# EasyEDA Pro project Board.eprj, board PCB
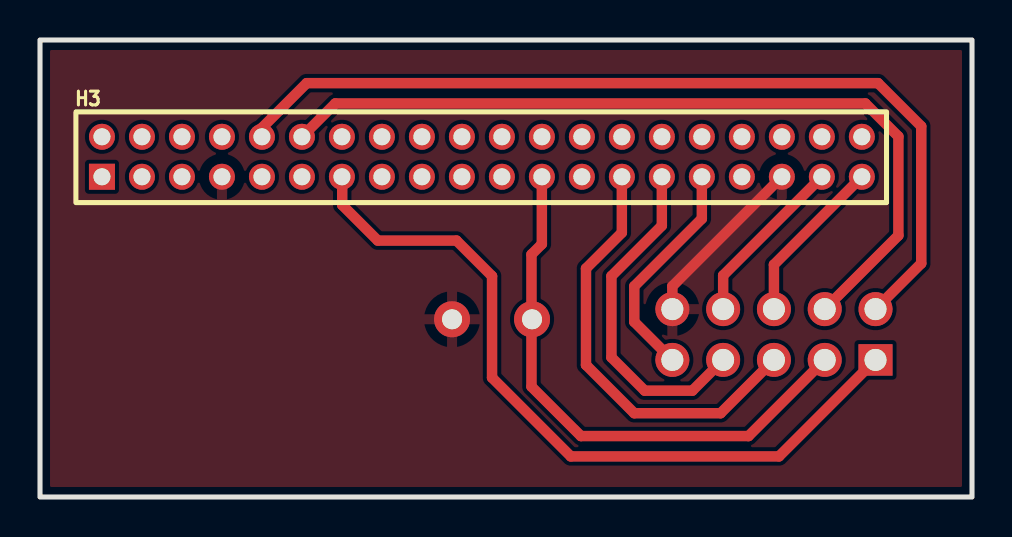
[diagram p2: board, top side]
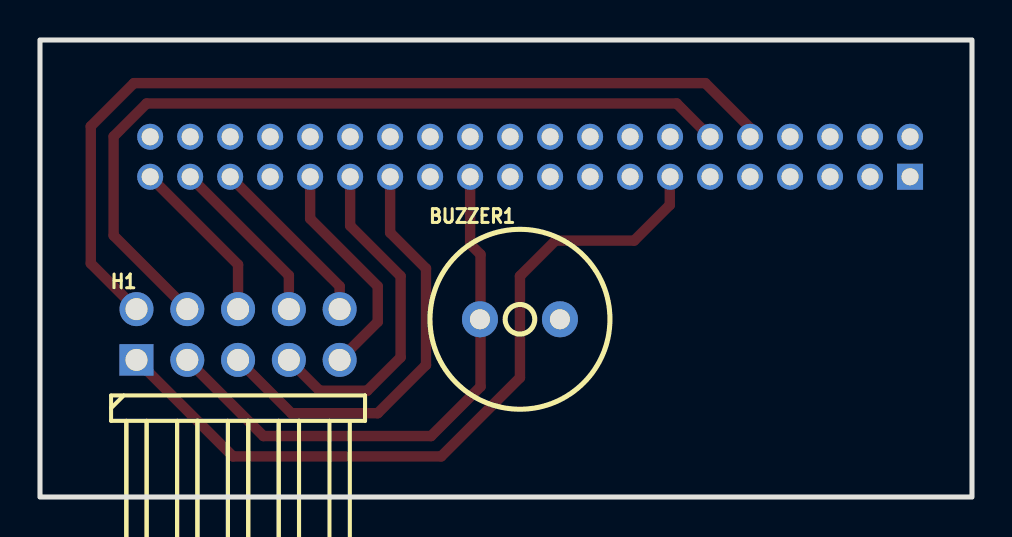
[diagram p3: board, bottom side, seen from below]

Outline 46.61 x 22.86 mm; copper layers: Top Layer, Bottom Layer. Coordinates in mm from the lower left corner of the outline.
Outline path: rectangle 0,22.86 46.61,0
Stack: Top Layer 0.035mm / Dielectric1 1.51mm FR4 er 4.5 / Bottom Layer 0.035mm

## Design rules (mm)
template: Custom Config
spacing copperThickness1oz (default): track to track 0.102, other pairs 0.152 to 0.3
spacing copperThickness2oz: track to track 0.203, other pairs 0.152 to 0.3
track width copperThickness1oz (default): min 0.127, default 0.254, max 2.54
track width copperThickness2oz: min 0.203, default 0.254, max 2.54
differential pair differentialPair (default): width min 0.127, default 0.254, max 2.54; gap min 0.152, default 0.152
via viaSize (default): diameter min 0.5, default 0.61, max 10; hole min 0.3, default 0.305, max 6.3
pour e0 uses copperRegion

## Placement (name value [footprint] x y rotation side)
BUZZER1  2.7kHz  [BUZ-TH_BD9.0-P4.00-D0.6-FD]  22.61 8.89 180 bottom
H1  2.54-2*5P弯针  [HDR-TH_10P-P2.54-H-M-R2-C5-S2.54-W12.9]  36.7 8.13 180 bottom
H3  2.0-2*20P母  [HDR-TH_40P-P2.00-V-F-R2-C20-S2.00]  22.1 17.02 0 top

## Footprints (pads in the part's own frame, mm; a bottom-side part is the same pattern mirrored in y, then rotated)
BUZ-TH_BD9.0-P4.00-D0.6-FD
  round 1.8 hole 1: 1(-2,0) 2(2,0)
HDR-TH_10P-P2.54-H-M-R2-C5-S2.54-W12.9
  rect 1.7x1.575 hole 1.1: 1(-5.08,-1.27)
  round 1.7 hole 1.1: 2(-5.08,1.27) 3(-2.54,-1.27) 4(-2.54,1.27) 5(0,-1.27) 6(0,1.27) 7(2.54,-1.27) 8(2.54,1.27) 9(5.08,-1.27) 10(5.08,1.27)
HDR-TH_40P-P2.00-V-F-R2-C20-S2.00
  rect 1.3x1.3 hole 0.85: 1(-19,-1)
  round 1.3 hole 0.85: 2(-19,1) 3(-17,-1) 4(-17,1) 5(-15,-1) 6(-15,1) 7(-13,-1) 8(-13,1) 9(-11,-1) 10(-11,1) 11(-9,-1) 12(-9,1) 13(-7,-1) 14(-7,1) 15(-5,-1) 16(-5,1) 17(-3,-1) 18(-3,1) 19(-1,-1) 20(-1,1) 21(1,-1) 22(1,1) 23(3,-1) 24(3,1) 25(5,-1) 26(5,1) 27(7,-1) 28(7,1) 29(9,-1) 30(9,1) 31(11,-1) 32(11,1) 33(13,-1) 34(13,1) 35(15,-1) 36(15,1) 37(17,-1) 38(17,1) 39(19,-1) 40(19,1)

## Nets
As in the schematic.

Pads without a net: H3 1 2 3 4 5 6 8 9 11 14 15 16 17 18 19 20 21 22 24 25 26 28 30 32 33 34 36 38 40

## Routing (per net, layer and track width the routed paths; a pad name or vN(x,y) marks a point on that pad's centre or on a via; arc(x,y) is an arc through that point)
3.3V: length 8.7
  Top Layer w0.52: H1.8 34.16,11.08 H3.37
5V: length 8.4
  Top Layer w0.52: H3.39 36.7,11.62 H1.6
GND: length 8.9
  Top Layer w0.52: H3.35 31.62,10.54 H1.10
BUZZ: length 28
  Top Layer w0.52: H1.3 35.43,3.05 27.05,3.05 24.58,5.52 24.58,12.13 25.1,12.65 H3.23
CD2: length 17
  Top Layer w0.52: H1.7 32.62,5.32 30.24,5.32 28.58,6.98 28.58,11.05 31.1,13.57 H3.29
IO33: length 11.3
  Top Layer w0.52: H1.9 29.72,8.76 29.72,10.54 33.1,13.92 H3.31
RX: length 38.3
  Top Layer w0.52: H1.1 36.96,2.03 26.54,2.03 22.61,5.97 22.61,11.05 20.83,12.83 16.89,12.83 15.11,14.61 15.11,16 H3.13
SCL: length 41.4
  Top Layer w0.52: H1.4 42.93,13.08 42.93,18.03 41.27,19.69 14.77,19.69 H3.12
SDA: length 45.3
  Top Layer w0.52: H1.2 44.07,11.68 44.07,18.54 41.91,20.7 13.33,20.7 11.1,18.46 H3.10
TX: length 21.7
  Top Layer w0.52: H3.27 29.1,13.22 27.3,11.43 27.3,6.6 29.72,4.19 34.04,4.19 H1.5

## Copper pours and planes (outline as drawn; the poured copper is in the pictures)
GND on Top Layer: 0,22.86 46.61,22.86 46.61,0 0,0
